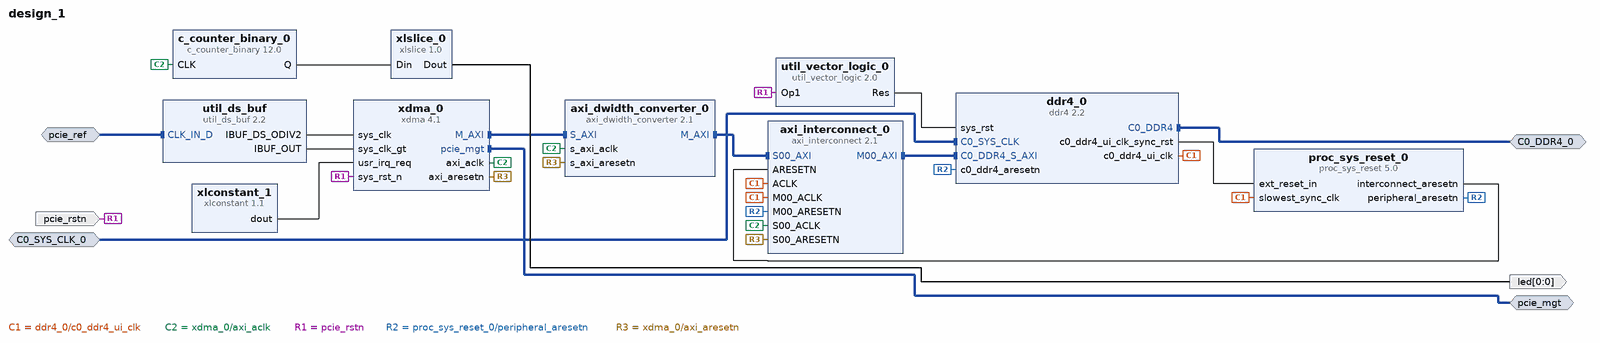
[diagram p0: block diagram of the top level]
# Vivado block design design_1, xcau15p-ffvb676-2-i, Vivado 2023.2.1
create_bd_design design_1

create_bd_intf_port -mode Master -vlnv xilinx.com:interface:pcie_7x_mgt_rtl:1.0 pcie_mgt
create_bd_intf_port -mode Slave -vlnv xilinx.com:interface:diff_clock_rtl:1.0 pcie_ref
set_property -dict {CONFIG.FREQ_HZ 100000000} [get_bd_intf_ports pcie_ref]
create_bd_intf_port -mode Master -vlnv xilinx.com:interface:ddr4_rtl:1.0 C0_DDR4_0
create_bd_intf_port -mode Slave -vlnv xilinx.com:interface:diff_clock_rtl:1.0 C0_SYS_CLK_0
set_property -dict {CONFIG.FREQ_HZ 200000000} [get_bd_intf_ports C0_SYS_CLK_0]
create_bd_port -dir I -type rst pcie_rstn
set_property -dict {CONFIG.POLARITY ACTIVE_LOW} [get_bd_ports pcie_rstn]
create_bd_port -dir O -from 0 -to 0 led

create_bd_cell -type ip -vlnv xilinx.com:ip:xlslice:1.0 xlslice_0
set_property -dict {CONFIG.DIN_FROM 0 CONFIG.DIN_WIDTH 26} [get_bd_cells xlslice_0]
create_bd_cell -type ip -vlnv xilinx.com:ip:util_vector_logic:2.0 util_vector_logic_0
set_property -dict {CONFIG.C_OPERATION not CONFIG.C_SIZE 1} [get_bd_cells util_vector_logic_0]
create_bd_cell -type ip -vlnv xilinx.com:ip:proc_sys_reset:5.0 proc_sys_reset_0
create_bd_cell -type ip -vlnv xilinx.com:ip:axi_interconnect:2.1 axi_interconnect_0
set_property -dict [list \
  CONFIG.ENABLE_ADVANCED_OPTIONS 1 \
  CONFIG.NUM_MI 1 \
  CONFIG.S00_HAS_DATA_FIFO 2 \
  CONFIG.XBAR_DATA_WIDTH 128 \
] [get_bd_cells axi_interconnect_0]
create_bd_cell -type ip -vlnv xilinx.com:ip:c_counter_binary:12.0 c_counter_binary_0
set_property -dict {CONFIG.Output_Width 26} [get_bd_cells c_counter_binary_0]
create_bd_cell -type ip -vlnv xilinx.com:ip:ddr4:2.2 ddr4_0
set_property -dict [list \
  CONFIG.ADDN_UI_CLKOUT1_FREQ_HZ None \
  CONFIG.C0.BANK_GROUP_WIDTH 1 \
  CONFIG.C0.DDR4_AxiAddressWidth 30 \
  CONFIG.C0.DDR4_AxiDataWidth 128 \
  CONFIG.C0.DDR4_CasLatency 16 \
  CONFIG.C0.DDR4_DataWidth 16 \
  CONFIG.C0.DDR4_InputClockPeriod 4998 \
  CONFIG.C0.DDR4_MemoryPart MT40A512M16HA-083E \
  CONFIG.C0.DDR4_TimePeriod 833 \
] [get_bd_cells ddr4_0]
create_bd_cell -type ip -vlnv xilinx.com:ip:util_ds_buf:2.2 util_ds_buf
set_property -dict {CONFIG.C_BUF_TYPE IBUFDSGTE} [get_bd_cells util_ds_buf]
create_bd_cell -type ip -vlnv xilinx.com:ip:xdma:4.1 xdma_0
set_property -dict [list \
  CONFIG.PF0_DEVICE_ID_mqdma 9044 \
  CONFIG.PF0_SRIOV_VF_DEVICE_ID A044 \
  CONFIG.PF2_DEVICE_ID_mqdma 9244 \
  CONFIG.PF3_DEVICE_ID_mqdma 9344 \
  CONFIG.PHY_LP_TXPRESET 5 \
  CONFIG.axi_data_width 256_bit \
  CONFIG.axisten_freq 250 \
  CONFIG.cfg_mgmt_if true \
  CONFIG.disable_gt_loc true \
  CONFIG.en_gt_selection false \
  CONFIG.enable_ltssm_dbg false \
  CONFIG.mode_selection Advanced \
  CONFIG.pf0_device_id 9044 \
  CONFIG.pl_link_cap_max_link_speed 16.0_GT/s \
  CONFIG.pl_link_cap_max_link_width X4 \
  CONFIG.xdma_axi_intf_mm AXI_Memory_Mapped \
  CONFIG.xdma_pcie_64bit_en true \
  CONFIG.xdma_pcie_prefetchable true \
] [get_bd_cells xdma_0]
create_bd_cell -type ip -vlnv xilinx.com:ip:xlconstant:1.1 xlconstant_1
set_property -dict {CONFIG.CONST_VAL 0} [get_bd_cells xlconstant_1]
create_bd_cell -type ip -vlnv xilinx.com:ip:axi_dwidth_converter:2.1 axi_dwidth_converter_0
set_property -dict {CONFIG.MI_DATA_WIDTH 128 CONFIG.SI_DATA_WIDTH 256} [get_bd_cells axi_dwidth_converter_0]

# ---- connections ----

connect_bd_intf_net -intf_net C0_SYS_CLK_0_1 [get_bd_intf_ports C0_SYS_CLK_0] [get_bd_intf_pins ddr4_0/C0_SYS_CLK]
connect_bd_intf_net [get_bd_intf_pins axi_dwidth_converter_0/M_AXI] [get_bd_intf_pins axi_interconnect_0/S00_AXI]
connect_bd_intf_net [get_bd_intf_pins axi_interconnect_0/M00_AXI] [get_bd_intf_pins ddr4_0/C0_DDR4_S_AXI]
connect_bd_intf_net [get_bd_intf_ports C0_DDR4_0] [get_bd_intf_pins ddr4_0/C0_DDR4]
connect_bd_intf_net -intf_net diff_clock_rtl_0_1 [get_bd_intf_ports pcie_ref] [get_bd_intf_pins util_ds_buf/CLK_IN_D]
connect_bd_intf_net [get_bd_intf_pins xdma_0/M_AXI] [get_bd_intf_pins axi_dwidth_converter_0/S_AXI]
connect_bd_intf_net [get_bd_intf_ports pcie_mgt] [get_bd_intf_pins xdma_0/pcie_mgt]
connect_bd_net -net ACLK_1 [get_bd_pins ddr4_0/c0_ddr4_ui_clk] \
  [get_bd_pins axi_interconnect_0/ACLK] [get_bd_pins axi_interconnect_0/M00_ACLK] \
  [get_bd_pins proc_sys_reset_0/slowest_sync_clk]
connect_bd_net -net ARESETN_1 [get_bd_pins proc_sys_reset_0/interconnect_aresetn] [get_bd_pins axi_interconnect_0/ARESETN]
connect_bd_net -net S00_ACLK_1 [get_bd_pins xdma_0/axi_aclk] \
  [get_bd_pins axi_dwidth_converter_0/s_axi_aclk] [get_bd_pins axi_interconnect_0/S00_ACLK] \
  [get_bd_pins c_counter_binary_0/CLK]
connect_bd_net [get_bd_pins c_counter_binary_0/Q] [get_bd_pins xlslice_0/Din]
connect_bd_net [get_bd_pins ddr4_0/c0_ddr4_ui_clk_sync_rst] [get_bd_pins proc_sys_reset_0/ext_reset_in]
connect_bd_net [get_bd_ports pcie_rstn] [get_bd_pins util_vector_logic_0/Op1] [get_bd_pins xdma_0/sys_rst_n]
connect_bd_net [get_bd_pins proc_sys_reset_0/peripheral_aresetn] [get_bd_pins axi_interconnect_0/M00_ARESETN] [get_bd_pins ddr4_0/c0_ddr4_aresetn]
connect_bd_net [get_bd_pins util_ds_buf/IBUF_DS_ODIV2] [get_bd_pins xdma_0/sys_clk]
connect_bd_net [get_bd_pins util_ds_buf/IBUF_OUT] [get_bd_pins xdma_0/sys_clk_gt]
connect_bd_net [get_bd_pins util_vector_logic_0/Res] [get_bd_pins ddr4_0/sys_rst]
connect_bd_net [get_bd_pins xdma_0/axi_aresetn] [get_bd_pins axi_dwidth_converter_0/s_axi_aresetn] [get_bd_pins axi_interconnect_0/S00_ARESETN]
connect_bd_net [get_bd_pins xlconstant_1/dout] [get_bd_pins xdma_0/usr_irq_req]
connect_bd_net [get_bd_pins xlslice_0/Dout] [get_bd_ports led]

validate_bd_design
save_bd_design
